# EAGLE design led_serial_strip (EAGLE 6.4)
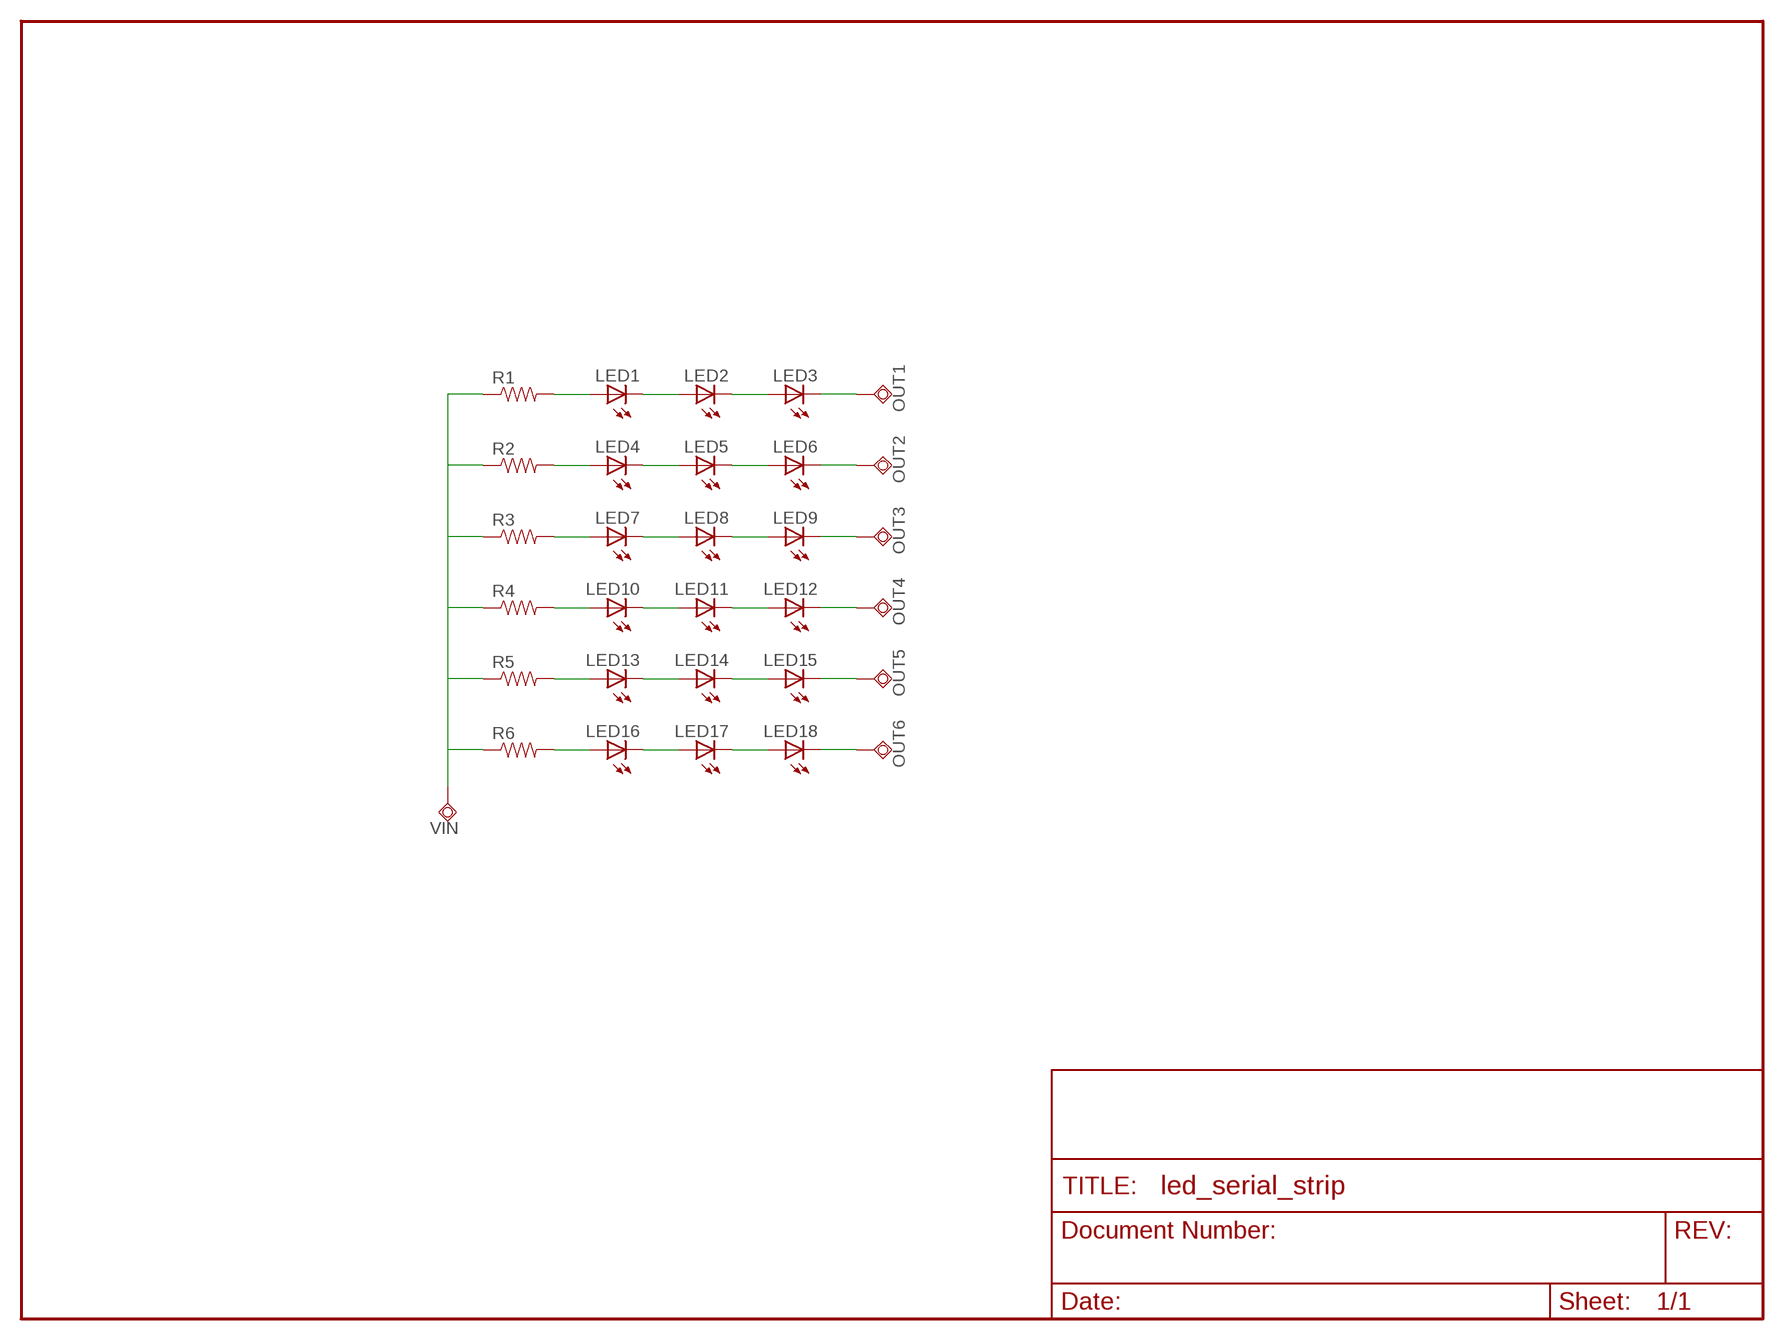
[diagram p0: schematic, sheet 1]

## Parts
LED1  LED0805  [LED_0805]
LED2  LED0805  [LED_0805]
LED3  LED0805  [LED_0805]
LED4  LED0805  [LED_0805]
LED5  LED0805  [LED_0805]
LED6  LED0805  [LED_0805]
LED7  LED0805  [LED_0805]
LED8  LED0805  [LED_0805]
LED9  LED0805  [LED_0805]
LED10  LED0805  [LED_0805]
LED11  LED0805  [LED_0805]
LED12  LED0805  [LED_0805]
LED13  LED0805  [LED_0805]
LED14  LED0805  [LED_0805]
LED15  LED0805  [LED_0805]
LED16  LED0805  [LED_0805]
LED17  LED0805  [LED_0805]
LED18  LED0805  [LED_0805]
OUT1  TPSQTP15SQ  [TP15SQ]
OUT2  TPSQTP15SQ  [TP15SQ]
OUT3  TPSQTP15SQ  [TP15SQ]
OUT4  TPSQTP15SQ  [TP15SQ]
OUT5  TPSQTP15SQ  [TP15SQ]
OUT6  TPSQTP15SQ  [TP15SQ]
R1  RESISTOR0805-RES  [0805]
R2  RESISTOR0805-RES  [0805]
R3  RESISTOR0805-RES  [0805]
R4  RESISTOR0805-RES  [0805]
R5  RESISTOR0805-RES  [0805]
R6  RESISTOR0805-RES  [0805]
VIN  TPSQTP15SQ  [TP15SQ]

## Nets
N$1: LED1.A R1.2
N$2: LED1.C LED2.A
N$3: LED2.C LED3.A
N$4: LED4.A R2.2
N$5: LED7.A R3.2
N$6: LED10.A R4.2
N$7: LED10.C LED11.A
N$8: LED11.C LED12.A
N$9: LED8.C LED9.A
N$10: LED5.C LED6.A
N$11: LED4.C LED5.A
N$12: LED7.C LED8.A
N$13: LED3.C OUT1.TP
N$14: LED6.C OUT2.TP
N$15: LED9.C OUT3.TP
N$16: LED12.C OUT4.TP
N$17: LED13.A R5.2
N$18: LED16.A R6.2
N$19: LED16.C LED17.A
N$20: LED17.C LED18.A
N$21: LED14.C LED15.A
N$22: LED13.C LED14.A
N$23: LED15.C OUT5.TP
N$24: LED18.C OUT6.TP
VIN: R1.1 R2.1 R3.1 R4.1 VIN.TP
VIN1: R5.1 R6.1

## Library data of the parts
LED1-LED18 = CyberRailGuru:LED: LEDs Standard schematic elements and footprints for 5mm, 3mm, 1206, and 0603 sized LEDs. 5mm - Spark Fun Electronics SKU : COM-00529 (and others)
OUT1-OUT6 VIN = CyberRailGuru:TPSQ: Test pad
R1-R6 = SparkFun:RESISTOR: Resistor Basic schematic elements and footprints for 0603, 1206, and PTH resistors.

## Board
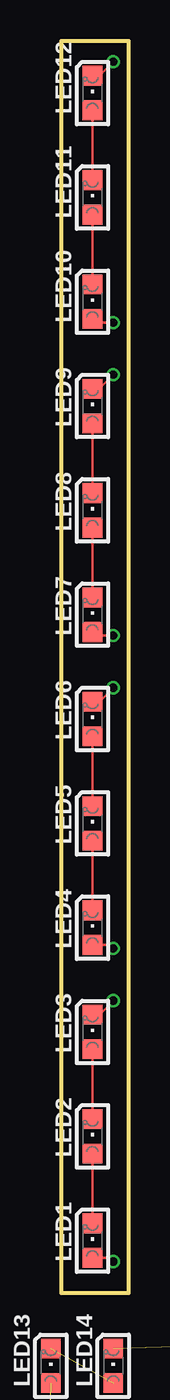
[diagram p1: board, top side]
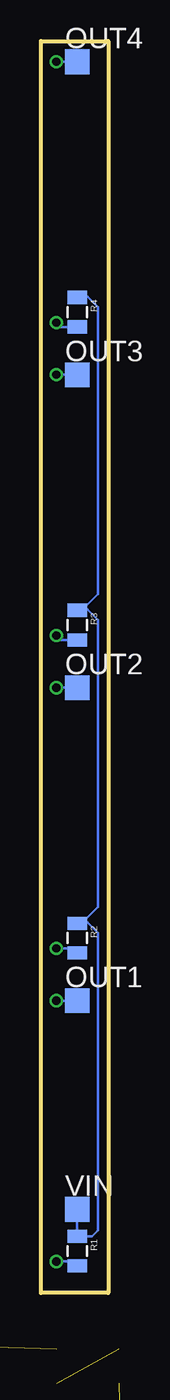
[diagram p2: board, bottom side, seen from below]

Size 4.12 x 76.19 mm. Coordinates in mm from the lower left corner, seen from the top.
Outline: 0,0 4.12,0 4.12,76.19 0,76.19 0,0
Copper layers (1*16): Top 0.035mm / dielectric 1.5mm / Bottom 0.035mm
Design rules "Fusion_eagle_rule_v1.1": minimum track width 6mil, minimum drill 12mil, track to track 6mil, track to pad 6mil, pad to pad 6mil, via to via 6mil, smd to smd 0mil, copper to edge 10mil, drill to drill 10mil, minimum pad ring 10mil, minimum via ring 6mil, stop-mask expansion 2mil, vias tented up to drill 100mil, thermal gap 10mil

### Footprints (pad centres in the part's own frame; a part is rotated, then mirrored left to right if it is on the bottom)
LED_0805 = smd 1.2 x 1.2: A 0,-1.05; C 0,1.05
TP15SQ = smd 1.5 x 1.5: TP 0,0
0805 = smd 0.8 x 1.2: 1 -0.9,0; 2 0.9,0

### Placement (x,y rotation side)
LED1  1.91,3.17 0 top
LED2  1.91,9.52 0 top
LED3  1.91,15.88 0 top
LED4  1.91,22.23 0 top
LED5  1.91,28.57 0 top
LED6  1.91,34.93 0 top
LED7  1.91,41.27 0 top
LED8  1.91,47.62 0 top
LED9  1.91,53.98 0 top
LED10  1.91,60.33 0 top
LED11  1.91,66.67 0 top
LED12  1.91,73.02 0 top
LED13  -0.64,-4.45 0 top  (outside the outline)
LED14  3.17,-4.45 0 top  (outside the outline)
LED15  99.69,0.63 0 top  (outside the outline)
LED16  -0.64,-10.8 0 top  (outside the outline)
LED17  3.17,-10.8 0 top  (outside the outline)
LED18  6.99,-10.8 0 top  (outside the outline)
OUT1  1.91,17.78 0 bottom
OUT2  1.91,36.83 0 bottom
OUT3  1.91,55.88 0 bottom
OUT4  1.91,74.93 0 bottom
OUT5  -1.91,-15.88 0 top  (outside the outline)
OUT6  3.81,-15.88 0 top  (outside the outline)
R1  1.91,2.54 270 bottom
R2  1.91,21.59 270 bottom
R3  1.91,40.64 270 bottom
R4  1.91,59.69 270 bottom
R5  -1.91,-19.05 0 top  (outside the outline)
R6  1.27,-19.05 0 top  (outside the outline)
VIN  1.91,5.08 0 bottom

### Tracks (layer width: path | path; a pad name or v marks a point on that pad's centre or on a via)
N$1  (via drill 0.5)
  Top 0.152: LED1.A 2.96,2.12 v3.17,1.91
  Bottom 0.152: v3.17,1.91 2.17,1.91 R1.2
N$2
  Top 0.152: LED1.C LED2.A
N$3
  Top 0.152: LED2.C LED3.A
N$4  (via drill 0.5)
  Top 0.152: LED4.A 2.96,21.18 v3.17,20.96
  Bottom 0.152: v3.17,20.96 2.17,20.96 R2.2
N$5  (via drill 0.5)
  Top 0.152: v3.17,40.01 2.12,40.01 LED7.A
  Bottom 0.152: R3.2 2.91,39.74 v3.17,40.01
N$6  (via drill 0.5)
  Top 0.152: v3.17,59.05 2.12,59.05 LED10.A
  Bottom 0.152: R4.2 2.91,58.79 v3.17,59.05
N$7
  Top 0.152: LED10.C LED11.A
N$8
  Top 0.152: LED11.C LED12.A
N$9
  Top 0.152: LED8.C LED9.A
N$10
  Top 0.152: LED5.C LED6.A
N$11
  Top 0.152: LED4.C LED5.A
N$12
  Top 0.152: LED7.C LED8.A
N$13  (via drill 0.5)
  Top 0.152: LED3.C 2.32,16.93 v3.17,17.78
  Bottom 0.152: v3.17,17.78 OUT1.TP
N$14  (via drill 0.5)
  Top 0.152: LED6.C 2.32,35.98 v3.17,36.83
  Bottom 0.152: v3.17,36.83 OUT2.TP
N$15  (via drill 0.5)
  Top 0.152: LED9.C 2.32,55.02 v3.17,55.88
  Bottom 0.152: v3.17,55.88 OUT3.TP
N$16  (via drill 0.5)
  Top 0.152: LED12.C 2.32,74.07 v3.17,74.93
  Bottom 0.152: v3.17,74.93 OUT4.TP
N$17  (1 unrouted)
N$18  (1 unrouted)
N$19  (1 unrouted)
N$20  (1 unrouted)
N$21  (1 unrouted)
N$22  (1 unrouted)
N$23  (1 unrouted)
N$24  (1 unrouted)
VIN
  Bottom 0.152: VIN.TP R1.1 1,3.44 0.64,3.81 0.64,21.91 1.27,22.54 1.85,22.54 R2.1 1.64,22.49 0.64,23.5 0.64,40.96 1.27,41.59 1.85,41.59 R3.1 1.64,41.54 0.64,42.55 0.64,60.01 1.27,60.64 1.85,60.64 R4.1
VIN1  (1 unrouted)